# Altium schematic sheet imxbbdvi.SchDoc: IMXBB
size A3; DocumentNumber: 7; Revision: 2.0; SheetNumber: 7; SheetTotal: 9
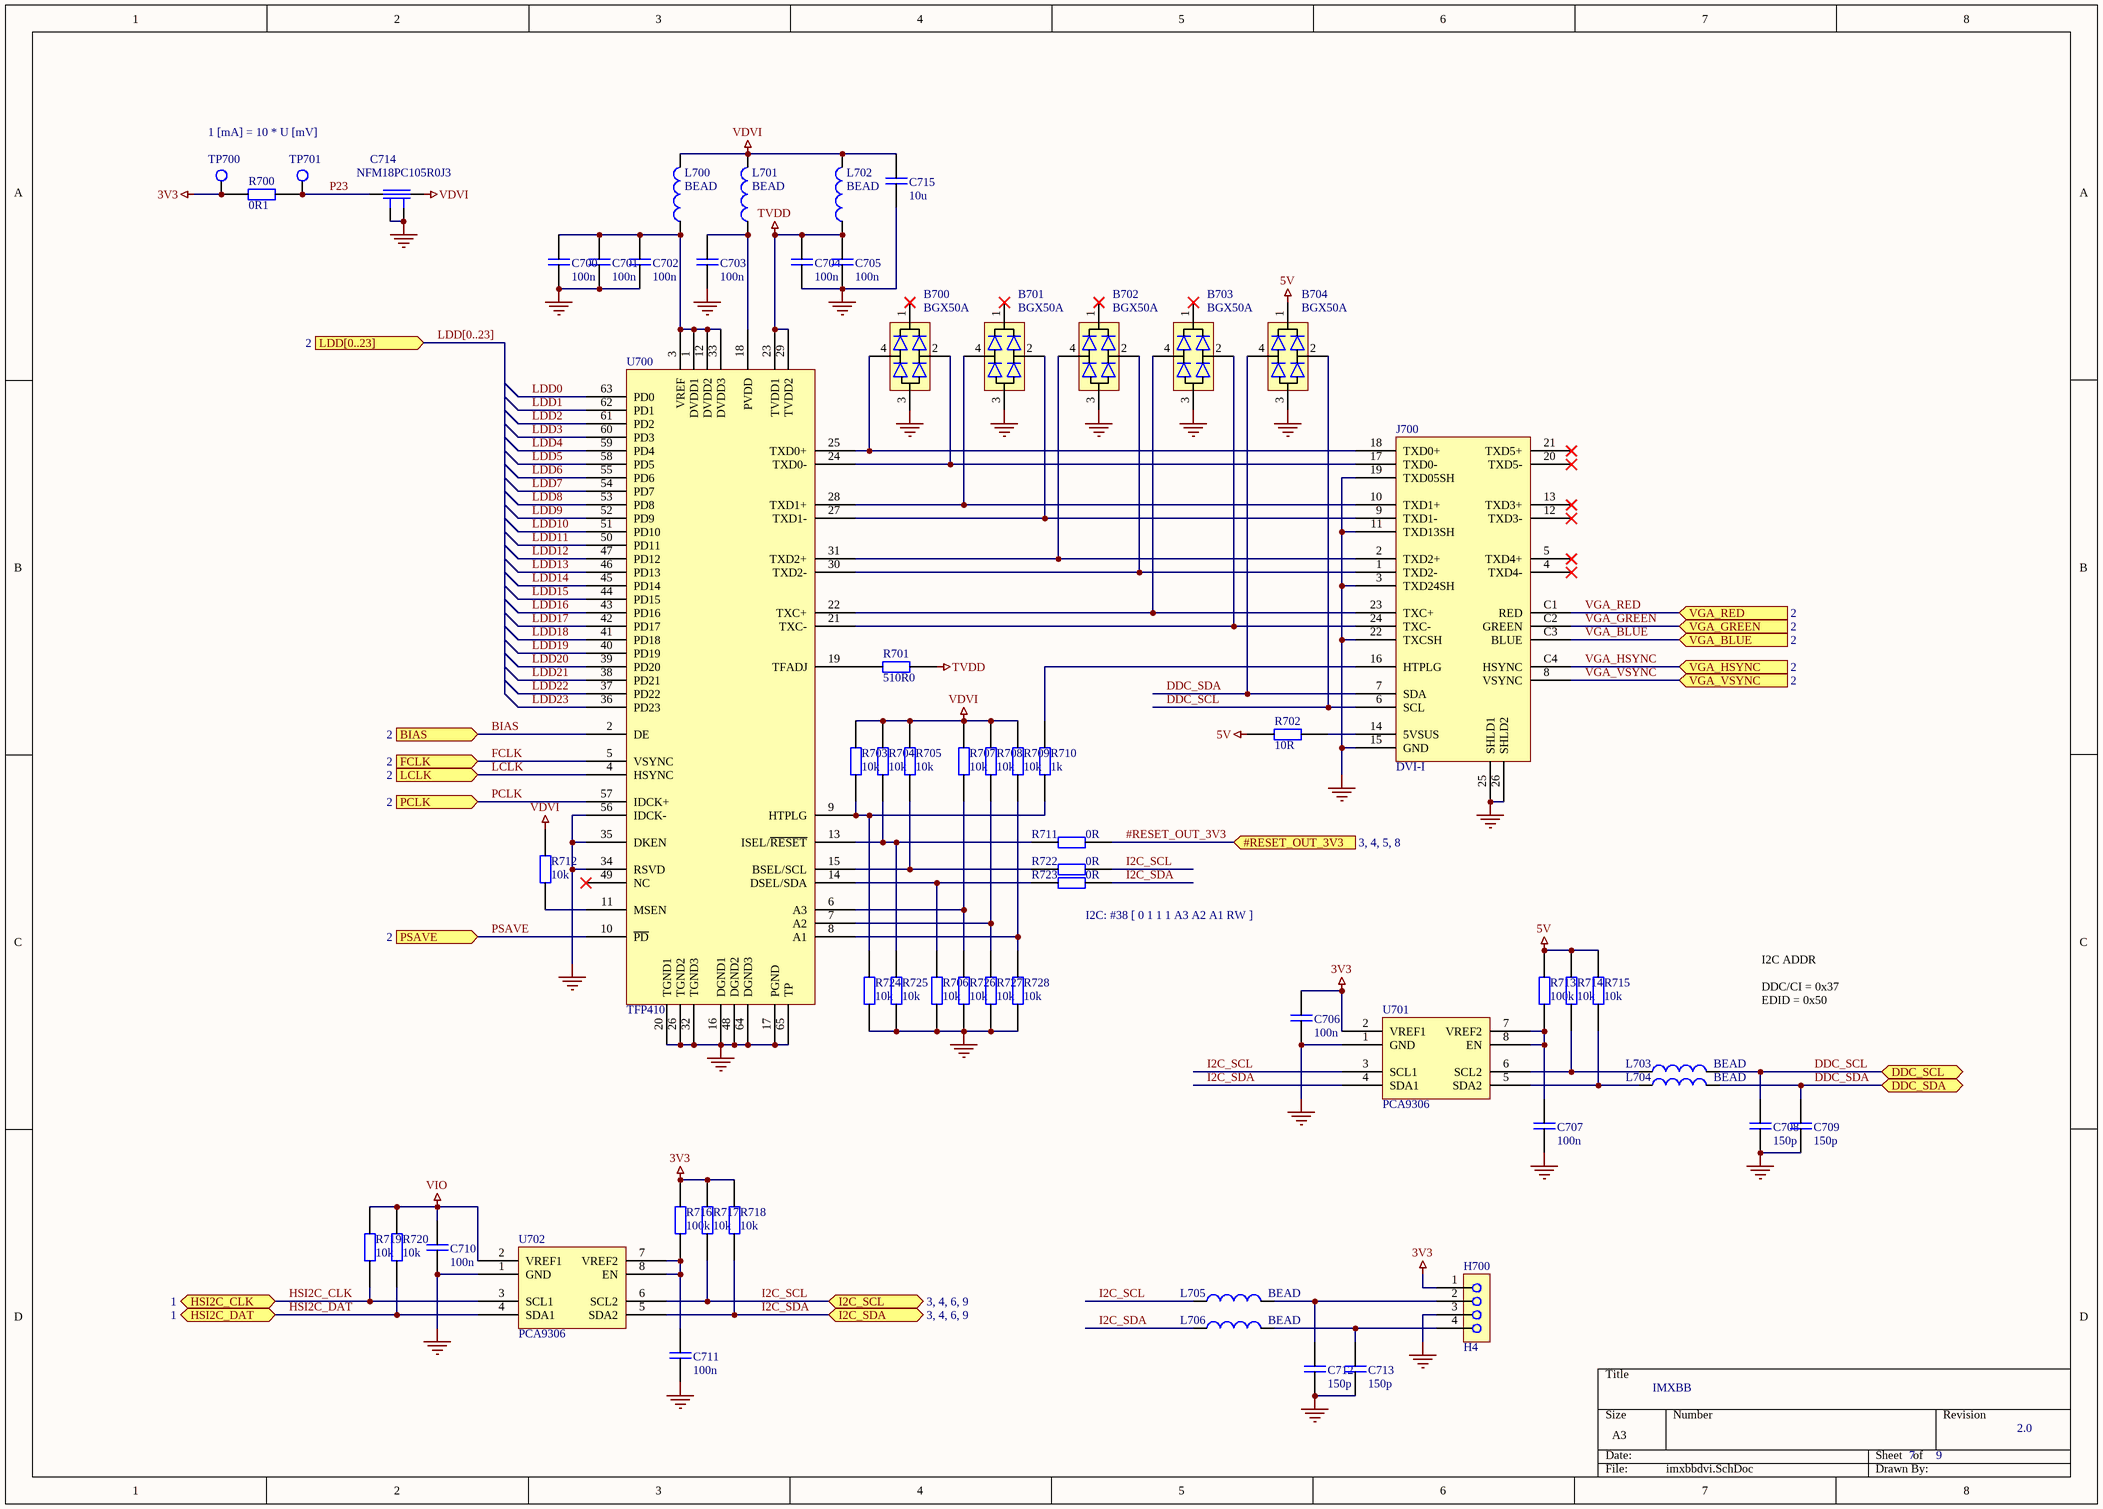
[diagram p0: imxbbdvi.SchDoc]

## Parts
B700  BGX50A  [SOT143]
B701  BGX50A  [SOT143]
B702  BGX50A  [SOT143]
B703  BGX50A  [SOT143]
B704  BGX50A  [SOT143]
C700  100n  [0603]
C701  100n  [0603]
C702  100n  [0603]
C703  100n  [0603]
C704  100n  [0603]
C705  100n  [0603]
C706  100n  [0603]
C707  100n  [0603]
C708  150p  [0603]
C709  150p  [0603]
C710  100n  [0603]
C711  100n  [0603]
C712  150p  [0603]
C713  150p  [0603]
C714  NFM18PC105R0J3  [NFM18P]
C715  10u  [0805]
H700  H4  [H1x4]
J700  DVI-I  [DVI_F_RA]
L700  BEAD  [0603]
L701  BEAD  [0603]
L702  BEAD  [0603]
L703  BEAD  [0603]
L704  BEAD  [0603]
L705  BEAD  [0603]
L706  BEAD  [0603]
R700  0R1  [0603]
R701  510R0  [0603]
R702  10R  [0603]
R703  10k  [0603]
R704  10k  [0603]
R705  10k  [0603]
R706  10k  [0603]
R707  10k  [0603]
R708  10k  [0603]
R709  10k  [0603]
R710  1k  [0603]
R711  0R  [0603]
R712  10k  [0603]
R713  100k  [0603]
R714  10k  [0603]
R715  10k  [0603]
R716  100k  [0603]
R717  10k  [0603]
R718  10k  [0603]
R719  10k  [0603]
R720  10k  [0603]
R722  0R  [0603]
R723  0R  [0603]
R724  10k  [0603]
R725  10k  [0603]
R726  10k  [0603]
R727  10k  [0603]
R728  10k  [0603]
TP700  TESTPOINT  [TESTPOINT_2mm]  (value not drawn)
TP701  TESTPOINT  [TESTPOINT_2mm]  (value not drawn)
U700  TFP410  [TQFP64]
U701  PCA9306  [TSSOP8]
U702  PCA9306  [TSSOP8]

## Ports
#RESET_OUT_3V3 (in, see 3, 4, 5, 8), BIAS (in, see 2), DDC_SCL (bidir), DDC_SDA (bidir), FCLK (in, see 2), HSI2C_CLK (bidir, see 1), HSI2C_DAT (bidir, see 1), I2C_SCL (bidir, see 3, 4, 6, 9), I2C_SDA (bidir, see 3, 4, 6, 9), LCLK (in, see 2), LDD[0..23] (in, see 2), PCLK (in, see 2), PSAVE (in, see 2), VGA_BLUE (in, see 2), VGA_GREEN (in, see 2), VGA_HSYNC (in, see 2), VGA_RED (in, see 2), VGA_VSYNC (in, see 2)

## Nets
3V3: C706.2 H700.1 R700.1 R716.1 R717.1 R718.1 TP700.1 U701.2(VREF1)
5V: B704.1 R702.2 R713.1 R714.1 R715.1
GND: B700.3 B701.3 B702.3 B703.3 B704.3 C700.1 C701.1 C702.1 C703.1 C704.1 C705.1 C706.1 C707.1 C708.1 C709.1 C710.1 C711.1 C712.1 C713.1 C714.2 C714.4 C715.1 H700.3 J700.3(TXD24SH) J700.11(TXD13SH) J700.15(GND) J700.19(TXD05SH) J700.22(TXCSH) J700.25(SHLD1) J700.26(SHLD2) R706.1 R724.2 R725.2 R726.2 R727.2 R728.2 U700.16(DGND1) U700.17(PGND) U700.20(TGND1) U700.26(TGND2) U700.32(TGND3) U700.34(RSVD) U700.35(DKEN) U700.48(DGND2) U700.56(IDCK-) U700.64(DGND3) U700.65(TP) U701.1(GND) U702.1(GND)
TVDD: C704.2 C705.2 L702.1 R701.1 U700.23(TVDD1) U700.29(TVDD2)
VDVI: C714.3 C715.2 L700.2 L701.2 L702.2 R703.1 R704.1 R705.1 R707.1 R708.1 R709.1 R712.1
VIO: C710.2 R719.1 R720.1 U702.2(VREF1)
#RESET_OUT_3V3: R711.1 ; port #RESET_OUT_3V3
BIAS: U700.2(DE) ; port BIAS
DDC_SCL: B704.2 C708.2 J700.6(SCL) L703.2 ; port DDC_SCL
DDC_SDA: B704.4 C709.2 J700.7(SDA) L704.2 ; port DDC_SDA
FCLK: U700.5(VSYNC) ; port FCLK
HSI2C_CLK: R719.2 U702.3(SCL1) ; port HSI2C_CLK
HSI2C_DAT: R720.2 U702.4(SDA1) ; port HSI2C_DAT
I2C_SCL: L705.1 R717.2 R722.1 U701.3(SCL1) U702.6(SCL2) ; port I2C_SCL
I2C_SDA: L706.1 R718.2 R723.1 U701.4(SDA1) U702.5(SDA2) ; port I2C_SDA
LCLK: U700.4(HSYNC) ; port LCLK
LDD0: U700.63(PD0)
LDD1: U700.62(PD1)
LDD2: U700.61(PD2)
LDD3: U700.60(PD3)
LDD4: U700.59(PD4)
LDD5: U700.58(PD5)
LDD6: U700.55(PD6)
LDD7: U700.54(PD7)
LDD8: U700.53(PD8)
LDD9: U700.52(PD9)
LDD10: U700.51(PD10)
LDD11: U700.50(PD11)
LDD12: U700.47(PD12)
LDD13: U700.46(PD13)
LDD14: U700.45(PD14)
LDD15: U700.44(PD15)
LDD16: U700.43(PD16)
LDD17: U700.42(PD17)
LDD18: U700.41(PD18)
LDD19: U700.40(PD19)
LDD20: U700.39(PD20)
LDD21: U700.38(PD21)
LDD22: U700.37(PD22)
LDD23: U700.36(PD23)
P23: C714.1 R700.2 TP701.1
PCLK: U700.57(IDCK+) ; port PCLK
PSAVE: U700.10(~{PD}) ; port PSAVE
VGA_BLUE: J700.C3(BLUE) ; port VGA_BLUE
VGA_GREEN: J700.C2(GREEN) ; port VGA_GREEN
VGA_HSYNC: J700.C4(HSYNC) ; port VGA_HSYNC
VGA_RED: J700.C1(RED) ; port VGA_RED
VGA_VSYNC: J700.8(VSYNC) ; port VGA_VSYNC
NetB700_2: B700.2 J700.17(TXD0-) U700.24(TXD0-)
NetB700_4: B700.4 J700.18(TXD0+) U700.25(TXD0+)
NetB701_2: B701.2 J700.9(TXD1-) U700.27(TXD1-)
NetB701_4: B701.4 J700.10(TXD1+) U700.28(TXD1+)
NetB702_2: B702.2 J700.1(TXD2-) U700.30(TXD2-)
NetB702_4: B702.4 J700.2(TXD2+) U700.31(TXD2+)
NetB703_2: B703.2 J700.24(TXC-) U700.21(TXC-)
NetB703_4: B703.4 J700.23(TXC+) U700.22(TXC+)
NetC700_2: C700.2 C701.2 C702.2 L700.1 U700.1(DVDD1) U700.3(VREF) U700.12(DVDD2) U700.33(DVDD3)
NetC703_2: C703.2 L701.1 U700.18(PVDD)
NetC707_2: C707.2 R713.2 U701.7(VREF2) U701.8(EN)
NetC711_2: C711.2 R716.2 U702.7(VREF2) U702.8(EN)
NetC712_2: C712.2 H700.2 L705.2
NetC713_2: C713.2 H700.4 L706.2
NetJ700_14: J700.14(5VSUS) R702.1
NetJ700_16: J700.16(HTPLG) R710.1
NetL703_1: L703.1 R714.2 U701.6(SCL2)
NetL704_1: L704.1 R715.2 U701.5(SDA2)
NetR701_2: R701.2 U700.19(TFADJ)
NetR703_2: R703.2 R710.2 R724.1 U700.9(HTPLG)
NetR704_2: R704.2 R711.2 R725.1 U700.13(ISEL/~{RESET})
NetR705_2: R705.2 R722.2 U700.15(BSEL/SCL)
NetR706_2: R706.2 R723.2 U700.14(DSEL/SDA)
NetR707_2: R707.2 R726.1 U700.6(A3)
NetR708_2: R708.2 R727.1 U700.7(A2)
NetR709_2: R709.2 R728.1 U700.8(A1)
NetR712_2: R712.2 U700.11(MSEN)

Not connected (* = marked no-connect by the designer): B700 1*; B701 1*; B702 1*; B703 1*; J700 4(TXD4-)* 5(TXD4+)* 12(TXD3-)* 13(TXD3+)* 20(TXD5-)* 21(TXD5+)*; U700 49(NC)*

## Buses and harness runs
bus LDD[0..23] = port LDD[0..23]

## Notes on the sheet
- 1 [mA] = 10 * U [mV]
- I2C: #38 [ 0 1 1 1 A3 A2 A1 RW ]
- I2C ADDR
  DDC/CI	= 0x37
  EDID	= 0x50

## Library data of the parts
C700-C713 C715 = C
C714 = NFL21S: Chip EMIFIL; Producer: Murata; Order number: NFM18PC105R0J3; Component class: C; Assembly type: SMT
L700-L706 = FBEAD
R700-R720 R722-R728 = R
TP700 TP701 = TESTPOINT: Testpoint pad; Order number: no component; Component class: TP; Producer: n/a; Assembly type: no component